# EAGLE board SparkFun GPS RTK Surveyor (EAGLE 9.6.2)
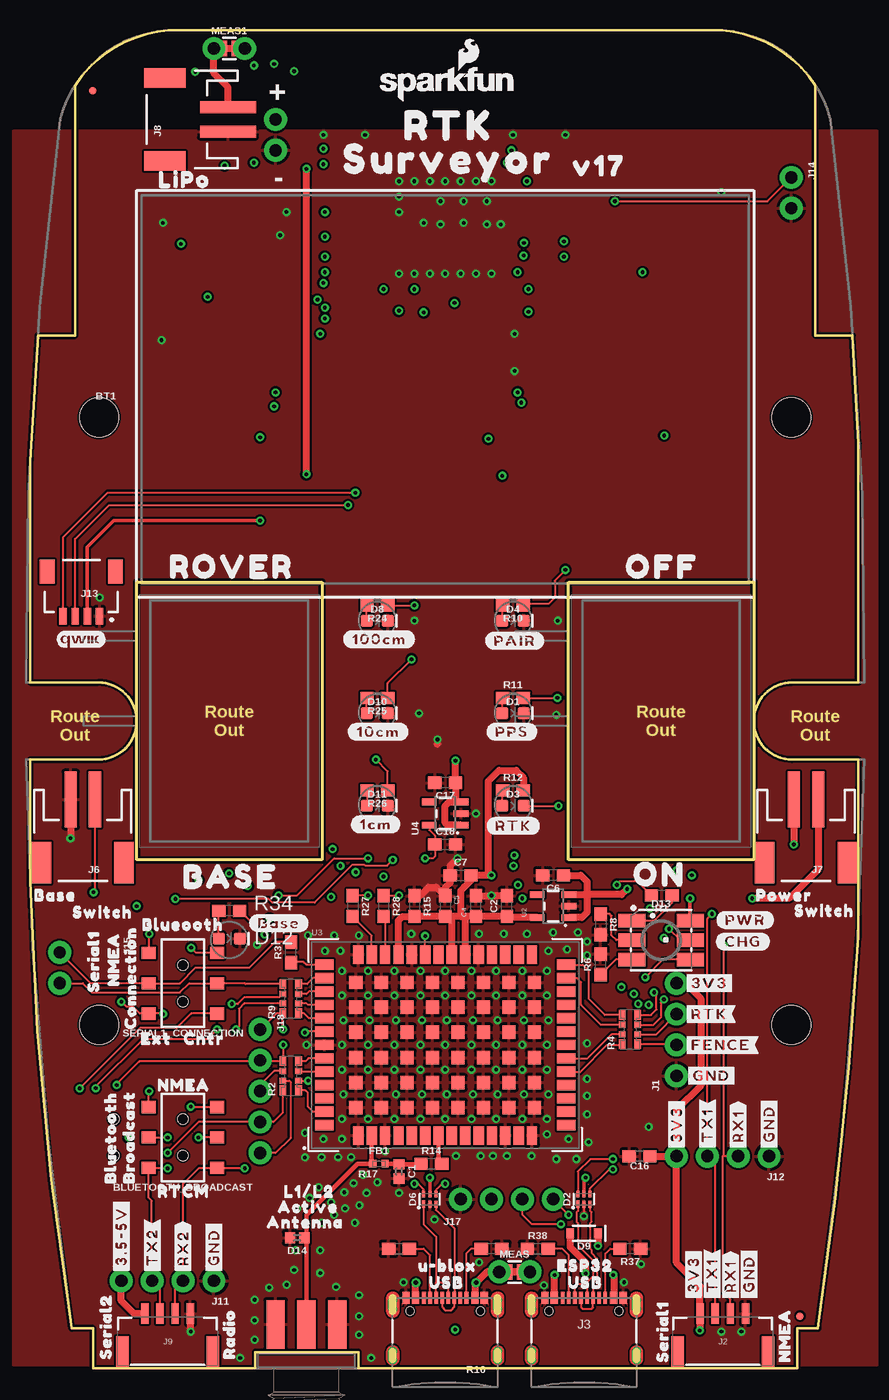
[diagram p2: board, top side]
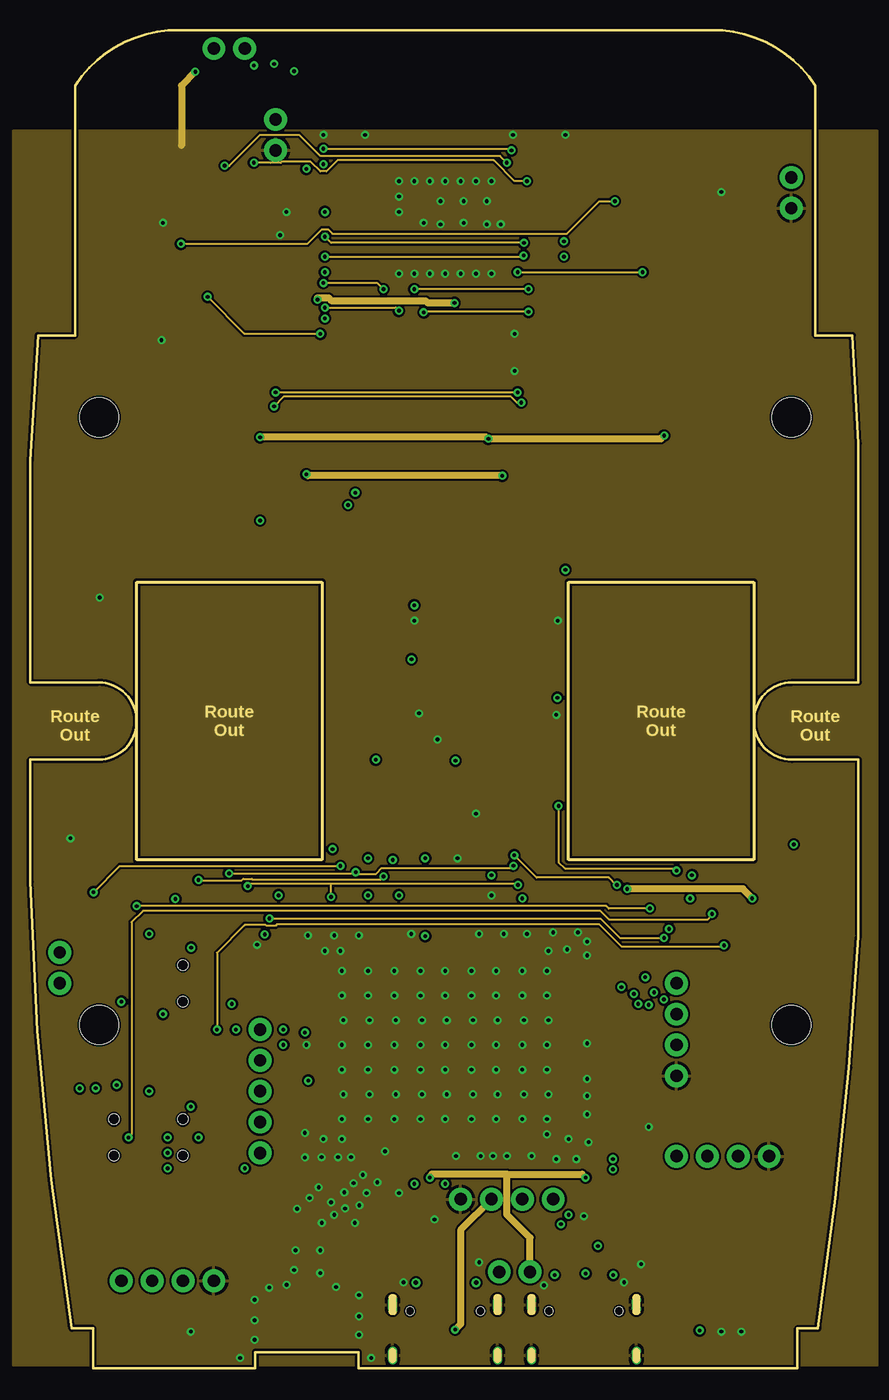
[diagram p3: board, inner layer Horz/GND]
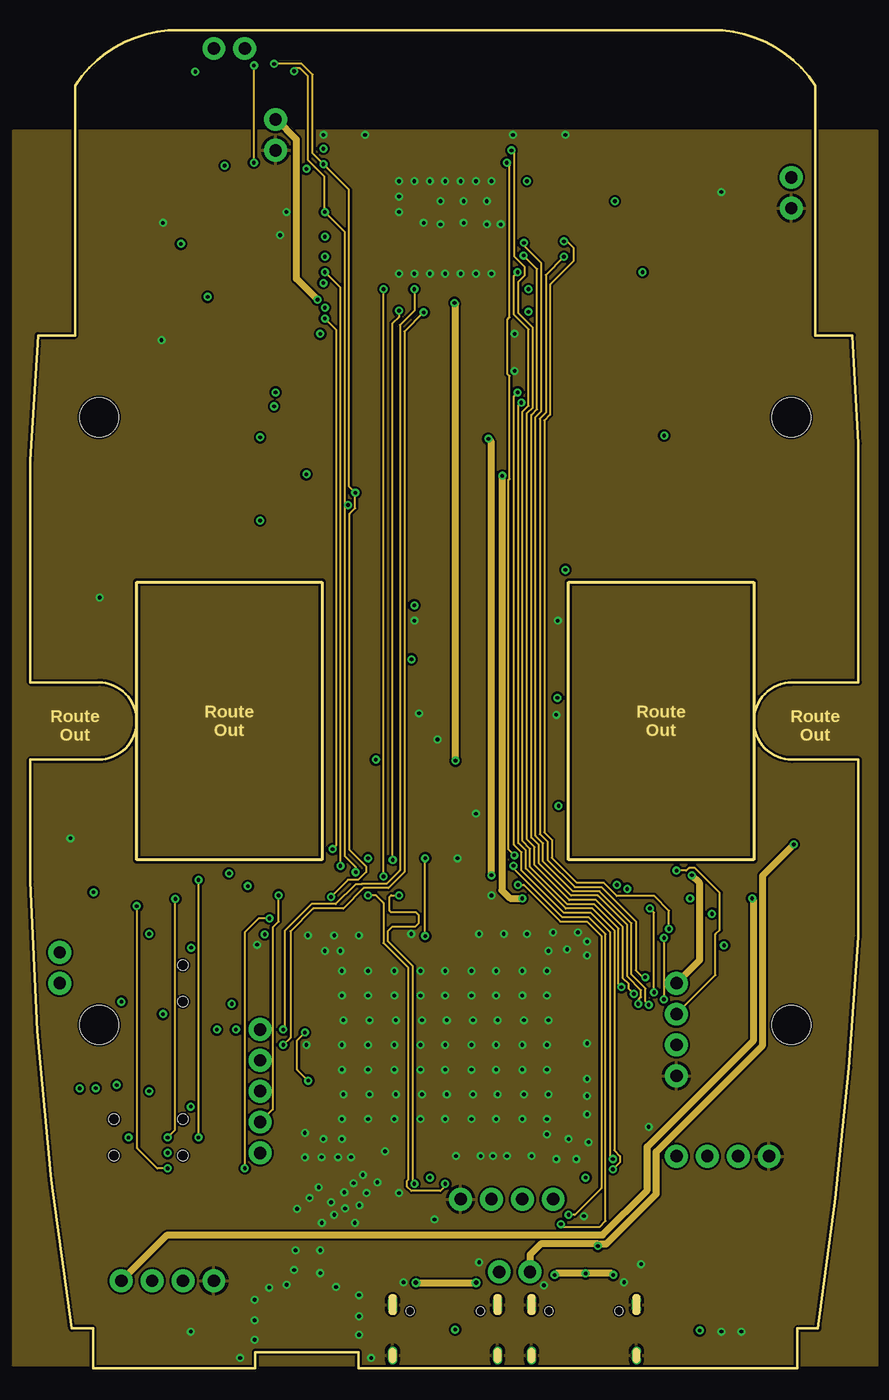
[diagram p4: board, inner layer Vert]
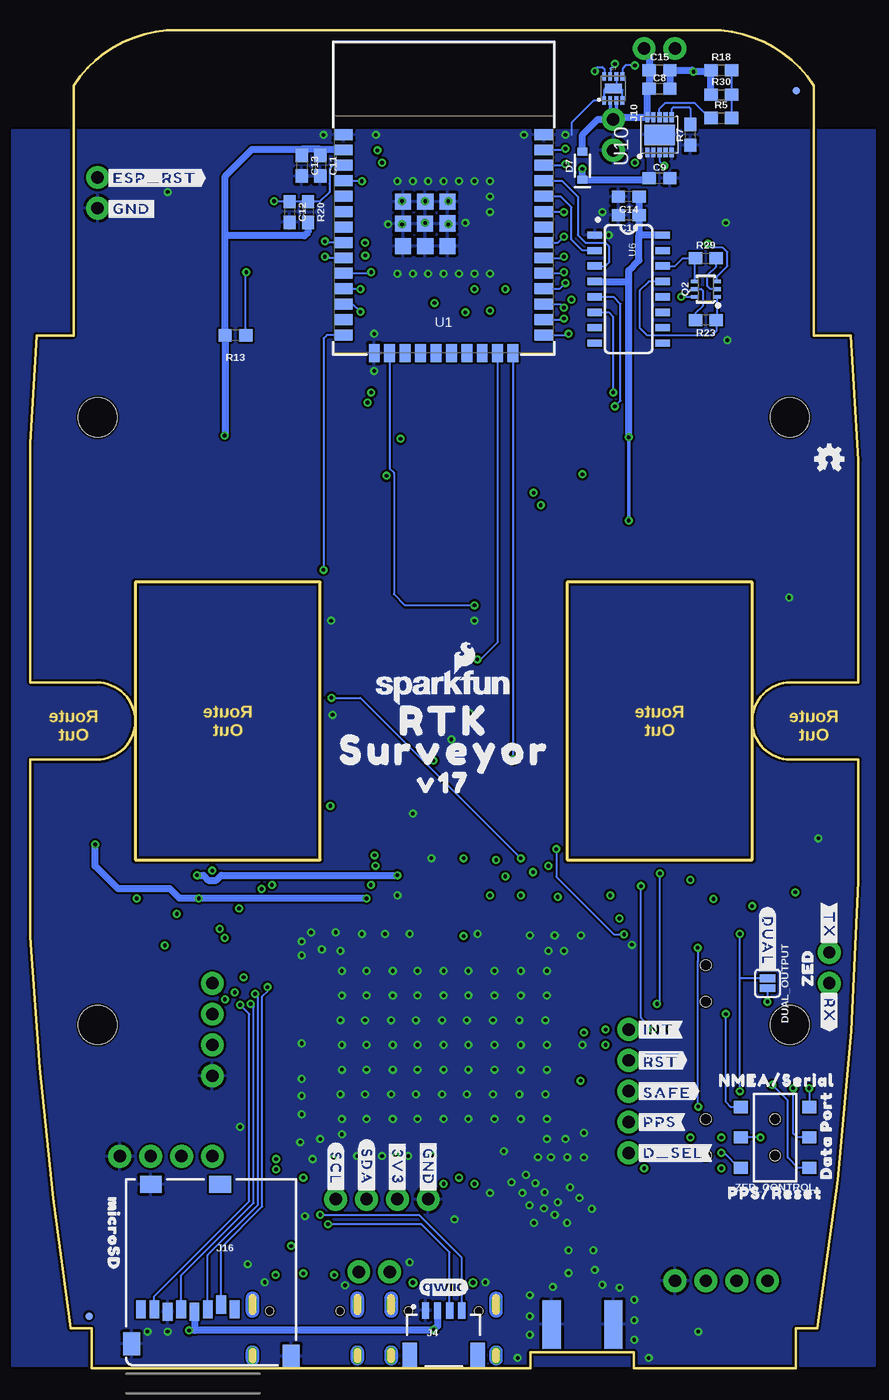
[diagram p5: board, bottom side, seen from below]

Size 68.2 x 110.14 mm. Coordinates in mm from the lower left corner, seen from the top.
Outline: 0,74.74 0,56.45 5.59,56.45 arc-180 5.59,50.1 0,50.1 0,40.07 arc8 3.41,3.27 5.16,3.27 5.16,0 18.51,0 18.51,1.32 27.01,1.32 27.01,0 63.16,0 63.16,3.27 64.86,3.27 arc5 68.2,35.5 68.2,50.1 62.74,50.1 arc-180 62.74,56.45 68.2,56.45 68.2,76.14 67.69,85.03 64.64,85.03 64.64,105.6 arc52 56.97,110.14 11.35,110.14 arc52 3.68,105.6 3.68,85.03 0.63,85.03 0,74.74
Outline: 0,74.74 0,74.87
Outline: 8.76,64.7 24,64.7 24,41.84 8.76,41.84 8.76,64.7
Outline: 44.32,64.7 59.56,64.7 59.56,41.84 44.32,41.84 44.32,64.7
Copper layers (1*2*15*16): Top 0.035559375mm / dielectric 0.47751875mm / Horz/GND 0.035559375mm / dielectric 0.47751875mm / Vert 0.035559375mm / dielectric 0.47751875mm / Bottom 0.035559375mm
Design rules "SparkFun-4-layer-TIGHT *": minimum track width 7mil, minimum drill 12mil, track to track 7mil, track to pad 7mil, pad to pad 7mil, via to via 7mil, smd to smd 7mil, copper to edge 7mil, drill to drill 7mil, minimum pad ring 7mil, minimum via ring 7mil, stop-mask expansion 4mil, vias tented up to drill 25mil, thermal gap 10mil
Net classes: 1 power: width 0.305 mm; 2 3.3V: width 0.559 mm; 3 RF: width 0.35 mm, clearance 0.203 mm

## Footprints (pad centres in the part's own frame; a part is rotated, then mirrored left to right if it is on the bottom)
SWITCH_DPDT_SMD_AYZ0202 = smd 1 x 1.15: 1 -2.5,2.825; 2 0,2.825; 3 2.5,2.825; 4 -2.5,-2.825; 5 0,-2.825; 6 2.5,-2.825 | hole 0.85: 1.5,0; -1.5,0
0402 = smd 0.85 x 0.9: 1 -0.58,0; 2 0.58,0
0603 = smd 1.1 x 1: 1 -0.85,0; 2 0.85,0
LED-0603 = smd 1 x 1: A -0.877,0; C 0.877,0
SOT886 = smd 0.61 x 0.25: 1 -0.405,0.5 | smd 0.56 x 0.25: 2 -0.43,0; 3 -0.43,-0.5; 4 0.43,-0.5; 5 0.43,0; 6 0.43,0.5
SOD-323 = smd 0.63 x 0.83: A 1.15,0; C -1.15,0
LED-TRICOLOR-5050 = smd 2.2 x 1.1: 1 -2.4,1.6; 2 -2.4,0; 3 -2.4,-1.6; 4 2.4,-1.6; 5 2.4,0; 6 2.4,1.6
SMT-JUMPER_2_NO_SILK = smd 0.635 x 1.27: 1 -0.406,0; 2 0.406,0
SMA-EDGE = smd 1.5 x 4: GND@0 -2.54,0; GND@1 2.54,0; SIG 0,0 | smd 1.5 x 4 bottom: GND@2 -2.54,0; GND@3 2.54,0
0402-TIGHT = smd 0.6 x 0.6: 1 -0.5,0; 2 0.5,0
1X04_NO_SILK = drill 1.016 pad 1.88: 1 0,0; 2 2.54,0; 3 5.08,0; 4 7.62,0
JST-4-SMD-1.25MM-LOCKING = smd 0.6 x 1.7: 1 -1.875,3.3; 2 -0.625,3.3; 3 0.625,3.3; 4 1.875,3.3 | smd 1 x 2.7: NC1 3.725,0.1; NC2 -3.725,0.1
USB-C-16P_4LAYER-PADS = smd 0.3 x 1: A5 -1.25,-0.34; A6 -0.25,-0.34; A7 0.25,-0.34; A8 1.25,-0.34; B5 1.75,-0.34; B6 0.75,-0.34; B7 -0.75,-0.34; B8 -1.75,-0.34 | smd 0.6 x 1: GND -3.225,-0.34; GND2 3.225,-0.34; VBUS1 -2.45,-0.34; VBUS2 2.45,-0.34 | drill 0.4 pad 0.6 long: SHLD1 -4.318,-0.915; SHLD2 4.318,-0.915; SHLD3 -4.318,-5.095; SHLD4 4.318,-5.095 | hole 0.65: -2.89,-1.445; 2.89,-1.445
JST04_1MM_RA = smd 0.6 x 1.35: 1 -1.5,0; 2 -0.5,0; 3 0.5,0; 4 1.5,0 | smd 1.2 x 2: NC1 2.8,-3.675; NC2 -2.8,-3.675
JST-2-SMD = smd 1 x 4.6: 1 -1,-3.7; 2 1,-3.7 | smd 1.6 x 3.4: NC1 -3.4,1.5; NC2 3.4,1.5
1X02_NO_SILK = drill 1.016 pad 1.88: 1 0,0; 2 2.54,0
MICRO-SD-SOCKET = smd 1.8 x 1.4: CD1 -2.05,0.4; CD2 -7.75,0.4 | smd 0.8 x 1.5: CS/DAT3 -7.84,10.3; DAT1 -1.24,10.7; DAT2 -8.94,10.7; DI/CMD -6.74,10.7; DO/DAT0 -2.34,10.7; GND -3.44,10.9; SCLK -4.54,10.7; VCC -5.64,10.9 | smd 1.4 x 1.9: GND1 -13.6,14.55; GND3 -0.45,13.55
1X05_NO_SILK = drill 1.016 pad 1.88: 1 0,0; 2 2.54,0; 3 5.08,0; 4 7.62,0; 5 10.16,0
FIDUCIAL-MICRO = smd 0.635 x 0.635: 1 0,0
COMBO-JUMPER_2_NC_TRACE = smd 0.635 x 1.27: 1 -0.508,0; 2 0.508,0 | drill 1.016 pad 1.88: 3 -1.27,0; 4 1.27,0
SC70-6 = smd 0.3 x 0.66: 1 -0.65,-0.92; 2 0,-0.92; 3 0.65,-0.92; 4 0.65,0.92; 5 0,0.92; 6 -0.65,0.92
1206_RA = smd 0.8 x 0.55: P1 -1.2,-0.62; P4 1.2,-0.62; P5 1.2,0.68; P8 -1.2,0.68 | smd 0.5 x 0.55: P2 -0.4,-0.62; P3 0.4,-0.62; P6 0.4,0.68; P7 -0.4,0.68
ESP-WROOM-32D-NARROW = smd 0.9 x 1.5: 1 6.43,8.238; 2 5.16,8.238; 3 3.89,8.238; 4 2.62,8.238; 5 1.35,8.238; 6 0.08,8.238; 7 -1.19,8.238; 8 -2.46,8.238; 9 -3.73,8.238; 10 -5,8.238; 11 -6.27,8.238; 12 -7.54,8.238; 13 -8.81,8.238; 14 -10.08,8.238; 25 -10.08,-8.238; 26 -8.81,-8.238; 27 -7.54,-8.238; 28 -6.27,-8.238; 29 -5,-8.238; 30 -3.73,-8.238; 31 -2.46,-8.238; 32 -1.19,-8.238; 33 0.08,-8.238; 34 1.35,-8.238; 35 2.62,-8.238; 36 3.89,-8.238; 37 5.16,-8.238; 38 6.43,-8.238 | smd 1.5 x 0.9: 15 -11.57,5.715; 16 -11.57,4.445; 17 -11.57,3.175; 18 -11.57,1.905; 19 -11.57,0.635; 20 -11.57,-0.635; 21 -11.57,-1.905; 22 -11.57,-3.175; 23 -11.57,-4.445; 24 -11.57,-5.715 | smd 1.33 x 1.33: GND1 -0.912,1.531; GNDT1 -2.751,3.346; GNDT2 -2.761,1.516; GNDT3 -2.751,-0.314; GNDT4 -0.891,-0.324; GNDT5 0.909,-0.314; GNDT6 0.909,1.516; GNDT7 0.909,3.346; GNDT8 -0.921,3.346
SOT23-5 = smd 0.55 x 1.2: 1 -0.95,-1.3; 2 0,-1.3; 3 0.95,-1.3; 4 0.95,1.3; 5 -0.95,1.3
ZED-F9P = smd 0.85 x 1.52: 1 -7.15,-7.45; 2 -6.05,-7.45; 3 -4.95,-7.45; 4 -3.85,-7.45; 5 -2.75,-7.45; 6 -1.65,-7.45; 7 -0.55,-7.45; 8 0.55,-7.45; 9 1.65,-7.45; 10 2.75,-7.45; 11 3.85,-7.45; 12 4.95,-7.45; 13 6.05,-7.45; 14 7.15,-7.45; 28 7.15,7.45; 29 6.05,7.45; 30 4.95,7.45; 31 3.85,7.45; 32 2.75,7.45; 33 1.65,7.45; 34 0.55,7.45; 35 -0.55,7.45; 36 -1.65,7.45; 37 -2.75,7.45; 38 -3.85,7.45; 39 -4.95,7.45; 40 -6.05,7.45; 41 -7.15,7.45 | smd 1.52 x 0.85: 15 9.95,-6.6; 16 9.95,-5.5; 17 9.95,-4.4; 18 9.95,-3.3; 19 9.95,-2.2; 20 9.95,-1.1; 21 9.95,0; 22 9.95,1.1; 23 9.95,2.2; 24 9.95,3.3; 25 9.95,4.4; 26 9.95,5.5; 27 9.95,6.6; 42 -9.95,6.6; 43 -9.95,5.5; 44 -9.95,4.4; 45 -9.95,3.3; 46 -9.95,2.2; 47 -9.95,1.1; 48 -9.95,0; 49 -9.95,-1.1; 50 -9.95,-2.2; 51 -9.95,-3.3; 52 -9.95,-4.4; 53 -9.95,-5.5; 54 -9.95,-6.6 | smd 1.1 x 1.1: 55 -1.05,-1.05; 56 -3.15,-1.05; 57 -5.25,-1.05; 58 -7.35,-1.05; 59 -1.05,-3.1; 60 -3.15,-3.1; 61 -5.25,-3.1; 62 -7.35,-3.1; 63 -1.05,-5.15; 64 -3.15,-5.15; 65 -5.25,-5.15; 66 -7.35,-5.15; 67 -1.05,5.15; 68 -3.15,5.15; 69 -5.25,5.15; 70 -7.35,5.15; 71 -1.05,3.1; 72 -3.15,3.1; 73 -5.25,3.1; 74 -7.35,3.1; 75 -1.05,1.05; 76 -3.15,1.05; 77 -5.25,1.05; 78 -7.35,1.05; 79 1.05,1.05; 80 3.15,1.05; 81 5.25,1.05; 82 7.35,1.05; 83 1.05,3.1; 84 3.15,3.1; 85 5.25,3.1; 86 7.35,3.1; 87 1.05,5.15; 88 3.15,5.15; 89 5.25,5.15; 90 7.35,5.15; 91 1.05,-5.15; 92 3.15,-5.15; 93 5.25,-5.15; 94 7.35,-5.15; 95 1.05,-3.1; 96 3.15,-3.1; 97 5.25,-3.1; 98 7.35,-3.1; 99 1.05,-1.05; 100 3.15,-1.05; 101 5.25,-1.05; 102 7.35,-1.05
SO016 = smd 0.6 x 1.2: 1 -4.445,-2.8; 2 -3.175,-2.8; 3 -1.905,-2.8; 4 -0.635,-2.8; 5 0.635,-2.8; 6 1.905,-2.8; 7 3.175,-2.8; 8 4.445,-2.8; 9 4.445,2.8; 10 3.175,2.8; 11 1.905,2.8; 12 0.635,2.8; 13 -0.635,2.8; 14 -1.905,2.8; 15 -3.175,2.8; 16 -4.445,2.8
DFN-8 = smd 0.3 x 0.7: 1 -0.75,-0.99; 2 -0.25,-0.99; 3 0.25,-0.99; 4 0.75,-0.99; 5 0.75,0.99; 6 0.25,0.99; 7 -0.25,0.99; 8 -0.75,0.99 | smd 1.38 x 0.8: 9 0,0
DFN-10 = smd 0.8 x 0.35: 1 -1.45,1; 2 -1.45,0.5; 3 -1.45,0; 4 -1.45,-0.5; 5 -1.45,-1; 6 1.45,-1; 7 1.45,-0.5; 8 1.45,0; 9 1.45,0.5; 10 1.45,1 | smd 1.7 x 2.5: 11 0,0
1553DBK-ENCLOSURE = hole 3.2: -25.006,28.499; 25.006,28.499; 25.006,-28.499; -25.006,-28.499

## Placement (x,y rotation side)
BLUETOOTH_BROADCAST  [SWITCH_DPDT_SMD_AYZ0202]  12.57,18.98 90 top
BT1  LIPO-OUTLINE1000  [LIPO-1000]  34.16,80.58 90 top
C1  47pF  [0402]  30.35,16.19 270 top
C2  1.0uF  [0603]  39.24,38.04 90 top
C4  1.0uF  [0603]  36.7,38.04 90 top
C5  0.1uF  [0603]  34.16,38.04 270 top
C6  1.0uF  [0603]  43.05,40.58 180 top
C7  0.1uF  [0603]  35.43,40.58 0 top
C8  4.7uF  [0603]  16.38,105.34 0 bottom
C9  4.7uF  [0603]  16.38,97.98 0 bottom
C10  10uF  [0603]  18.92,94.93 180 bottom
C11  0.1uF  [0603]  44.32,99 270 bottom
C12  0.1uF  [0603]  46.86,95.19 270 bottom
C13  0.1uF  [0603]  45.85,99 270 bottom
C14  10uF  [0603]  18.92,96.45 180 bottom
C15  0.1uF  [0603]  16.38,106.87 0 bottom
C16  0.1uF  [0603]  50.16,17.45 180 top
C17  1.0uF  [0603]  34.16,48.2 180 top
C18  1.0uF  [0603]  34.16,43.12 0 top
D1  Yellow  [LED-0603]  39.75,53.91 0 top
D2  PRTR5V0U2F  [SOT886]  45.59,13.91 90 top
D3  WHITE  [LED-0603]  39.75,46.29 0 top
D4  BLUE  [LED-0603]  39.75,61.53 0 top
D6  PRTR5V0U2F  [SOT886]  32.89,13.91 90 top
D7  3A/10V/280mV  [SOD-323]  22.73,99 90 bottom
D8  GREEN  [LED-0603]  28.58,61.53 0 top
D9  3A/10V/280mV  [SOD-323]  45.59,11.1 180 top
D10  GREEN  [LED-0603]  28.58,53.91 0 top
D11  GREEN  [LED-0603]  28.58,46.29 0 top
D12  RED  [LED-0603]  16.38,35.37 0 top
D13  [LED-TRICOLOR-5050]  51.94,35.24 0 top
D14  PESD0402  [0402]  21.97,10.73 180 top
DUAL_OUTPUT  [SMT-JUMPER_2_NO_SILK]  7.49,31.68 270 bottom
E1  SMA  [SMA-EDGE]  22.73,3.59 180 top
FB1  2.66Ω  [0402-TIGHT]  28.7,16.83 0 top
FRAME1  FRAME-LETTERNO_PACKAGE  [DUMMY]  91.31,6.28 0 top  (outside the outline)
FRAME2  FRAME-LEDGER  [CREATIVE_COMMONS]  91.31,6.28 0 top  (outside the outline)
J1  [1X04_NO_SILK]  53.21,24.06 90 top
J2  [JST-4-SMD-1.25MM-LOCKING]  57.02,1.19 0 top
J3  USB Female Type C Connector  [USB-C-16P_4LAYER-PADS]  45.59,6.14 0 top
J4  External  [JST04_1MM_RA]  34.16,4.74 0 bottom
J5  USB Female Type C Connector  [USB-C-16P_4LAYER-PADS]  34.16,6.14 0 top
J6  Start Base  [JST-2-SMD]  4.32,43.12 180 top
J7  Power Switch  [JST-2-SMD]  63.88,43.12 180 top
J8  [JST-2-SMD]  12.57,102.81 90 top
J9  [JST-4-SMD-1.25MM-LOCKING]  11.3,1.19 0 top
J10  [1X02_NO_SILK]  20.19,102.81 270 bottom
J11  [1X04_NO_SILK]  15.11,7.19 180 top
J12  [1X04_NO_SILK]  60.83,17.45 180 top
J13  Internal  [JST04_1MM_RA]  4.19,61.91 180 top
J14  [1X02_NO_SILK]  62.66,98.03 270 top
J15  [1X02_NO_SILK]  2.41,34.23 270 top
J16  microSD  [MICRO-SD-SOCKET]  60.32,15.54 180 bottom
J17  Qwiic Right Angle  [1X04_NO_SILK]  35.43,13.91 0 top
J18  [1X05_NO_SILK]  18.92,27.88 270 top
JP21  FIDUCIALUFIDUCIAL  [FIDUCIAL-MICRO]  63.37,4.28 0 top
JP61  FIDUCIALUFIDUCIAL  [FIDUCIAL-MICRO]  5.13,105.17 0 top
JP71  FIDUCIALUFIDUCIAL  [FIDUCIAL-MICRO]  63.37,4.28 0 bottom
JP81  FIDUCIALUFIDUCIAL  [FIDUCIAL-MICRO]  5.13,105.17 0 bottom
LOGO1  OSHW-LOGOMINI  [OSHW-LOGO-MINI]  2.41,74.87 0 bottom
LOGO2  SFE_LOGO_NAME_FLAME.1_INCH  [SFE_LOGO_NAME_FLAME_.1]  34.16,56.07 0 bottom
LOGO3  SFE_LOGO_NAME_FLAME.1_INCH  [SFE_LOGO_NAME_FLAME_.1]  34.36,105.73 0 top
MEAS  [COMBO-JUMPER_2_NC_TRACE]  39.88,7.92 0 top
MEAS1  [COMBO-JUMPER_2_NC_TRACE]  16.38,108.65 0 top
Q2  MBT3904DW1T1  [SC70-6]  12.57,88.84 90 bottom
R1  4.7k  [0603]  51.99,38.91 180 top
R2  33  [1206_RA]  21.46,24.06 90 top
R3  33  [0603]  21.46,34.23 90 top
R4  33  [1206_RA]  49.4,27.88 90 top
R5  0  [0603]  11.3,102.93 0 bottom
R6  1k  [0603]  46.96,33.23 90 top
R7  1k  [0603]  13.84,101.53 90 bottom
R8  1k  [0603]  46.96,36.54 270 top
R9  33  [1206_RA]  21.46,30.41 90 top
R10  330  [0603]  39.75,62.8 180 top
R11  20  [0603]  39.75,55.18 0 top
R12  330  [0603]  39.75,47.56 0 top
R13  100k  [0603]  51.31,85.03 180 bottom
R14  10  [0603]  33.02,16.83 0 top
R15  100k  [0603]  31.62,38.04 270 top
R16  5.1k  [0603]  37.97,9.83 180 top
R17  5.1k  [0603]  30.35,9.83 0 top
R18  10k  [0603]  11.3,106.87 0 bottom
R20  10k  [0603]  45.34,95.19 270 bottom
R23  10k  [0603]  12.57,86.3 180 bottom
R24  20  [0603]  28.58,62.8 180 top
R25  20  [0603]  28.58,55.18 180 top
R26  20  [0603]  28.58,47.56 180 top
R27  27  [0603]  26.54,38.04 270 top
R28  27  [0603]  29.08,38.04 270 top
R29  10k  [0603]  12.57,91.38 0 bottom
R30  150k  [0603]  11.3,104.84 0 bottom
R34  330  [0603]  16.38,37.65 180 top
R37  5.1k  [0603]  49.4,9.83 180 top
R38  5.1k  [0603]  41.78,9.83 0 top
SERIAL1_CONNECTION  [SWITCH_DPDT_SMD_AYZ0202]  12.57,31.68 90 top
U1  ESP-WROOM-3232D-NARROW  [ESP-WROOM-32D-NARROW]  34.16,95.14 90 bottom
U2  3.3V  [SOT23-5]  43.05,38.04 90 top
U3  U-BLOX_ZED-F9P  [ZED-F9P]  34.16,26.61 0 top
U4  3.3V  [SOT23-5]  34.16,45.66 90 top
U6  CH340C  [SO016]  18.92,88.84 270 bottom
U7  MAX17048  [DFN-8]  20.19,105.34 0 bottom
U10  MCP73833  [DFN-10]  16.38,101.53 90 bottom
U$1  [#GND#0]  53.85,24.06 0 top
U$2  SPECIAL_INSTRUCTIONS-ORDERING  [ORDERING_INSTRUCTIONS]  82.42,81.22 0 top  (outside the outline)
U$3  [ROCKER_SWITCH]  16.38,53.28 90 top
U$4  [#BASE#0]  18.03,36.64 0 top
U$5  [#3V3#0]  53.21,17.86 90 top
U$6  [ANTENNA0]  18.8,12 0 top
U$7  [RTK0]  34.16,53.28 0 bottom
U$8  [#CHG#0]  58.67,35.11 0 top
U$9  [_SURVEYOR3]  45.34,50.86 0 bottom
U$10  [#RTK#1]  53.72,29.14 0 top
U$11  [#PPS#0]  18.41,20.25 0 bottom
U$12  [#RTK#0]  37.59,44.64 0 top
U$13  [LIGHT_PIPE_3MM]  51.94,35.23 0 top
U$14  [#RX#2]  2.41,31.18 270 bottom
U$15  [LIGHT_PIPE_3MM]  16.39,35.25 0 top
U$16  [ZED0]  4.19,30.8 90 bottom
U$17  [##SAFE##5]  18.41,22.79 0 bottom
U$18  [ACTIVE0]  19.69,13.27 0 top
U$19  [L1#L21]  20.19,14.54 0 top
U$20  [#PAIR#0]  37.47,59.88 0 top
U$21  [LIGHT_PIPE_3MM]  28.56,46.38 0 top
U$22  [BASE2]  11.18,40.45 0 top
U$23  [#3#5#5V#0]  7.49,7.7 90 top
U$24  [#PPS#1]  37.59,52.39 0 top
U$25  [#PWR#2]  56.52,36.89 0 top
U$26  [1553DBK-ENCLOSURE]  34.16,53.28 90 top
U$27  [LIPO0]  12.7,97.85 0 top
U$28  [##RST##4]  18.41,25.33 0 bottom
U$29  [SERIAL10]  52.07,-0.18 90 top
U$30  [QWIIC_4MM]  34.16,6.65 0 bottom
U$31  [OFF1]  47.62,65.98 0 top
U$32  [#FENCE#3]  53.72,26.61 0 top
U$33  [#INT#0]  18.41,27.88 0 bottom
U$34  [ROCKER_SWITCH]  51.94,53.28 90 top
U$35  [U#BLOX0]  31.24,8.43 0 top
U$36  [USB1]  32.13,7.03 0 top
U$37  [#3V3#0]  53.72,31.68 0 top
U$38  [#GND#0]  15.11,7.7 90 top
U$39  [#RX2#2]  12.57,7.7 90 top
U$40  [#TX2#1]  10.03,7.7 90 top
U$41  [BLUETOOTH2]  6.6,14.54 90 top
U$42  [ON0]  48.26,40.65 0 top
U$43  [SERIAL20]  6.22,0.08 90 top
U$44  [ROVER3]  10.03,65.98 0 top
U$45  [#RX1#2]  57.66,5.51 90 top
U$46  [#TX1#1]  56.13,5.51 90 top
U$47  [#3V3#0]  54.61,5.51 90 top
U$48  [#GND#0]  59.18,5.51 90 top
U$49  [NMEA1]  62.1,-0.18 90 top
U$50  [RADIO0]  16.38,0.08 90 top
U$51  [BROADCAST3]  8.13,14.54 90 top
U$52  [NMEA1]  9.78,23.3 0 top
U$53  [RTCM0]  9.78,14.54 0 top
U$54  [BASE0]  -0.38,38.92 0 top
U$55  [SWITCH1]  2.79,37.53 0 top
U$56  [POWER0]  59.05,38.92 0 top
U$57  [SWITCH1]  62.23,37.65 0 top
U$58  [BLUEOOTH3]  8.51,36.51 0 top
U$59  [CNTR1]  11.94,27.11 0 top
U$60  [#ESP_RST#0]  62.1,97.98 0 bottom
U$61  [EXT0]  8.38,27.11 0 top
U$62  [NMEA2]  6.86,30.8 90 top
U$63  [SERIAL10]  5.21,30.29 90 top
U$64  [CONNECTION1]  8.25,27.24 90 top
U$65  [#TX1#1]  55.75,17.86 90 top
U$66  [USB1]  43.56,7.03 0 top
U$67  [ESP320]  42.67,8.43 0 top
U$68  [#RX1#2]  58.29,17.86 90 top
U$69  [LIGHT_PIPE_3MM]  39.76,46.38 0 top
U$70  [#GND#2]  35.43,16.57 270 bottom
U$71  [_SURVEYOR3]  23.16,99.53 0 top
U$72  [#TX#1]  2.41,38.29 270 bottom
U$73  [#DUAL#0]  7.49,37.91 270 bottom
U$74  [RTK0]  34.42,102.3 0 top
U$75  [LIGHT_PIPE_3MM]  39.76,53.98 0 top
U$76  [LIGHT_PIPE_3MM]  39.76,61.58 0 top
U$77  [LIGHT_PIPE_3MM]  28.56,61.58 0 top
U$78  [LIGHT_PIPE_3MM]  28.56,53.98 0 top
U$79  [#1CM#0]  26.42,44.77 0 top
U$80  [#10CM#1]  26.16,52.39 0 top
U$81  [#100CM#2]  25.78,60.01 0 top
U$82  [#GND#0]  60.83,17.86 90 top
U$83  [MICROSD0]  61.34,14.76 270 bottom
U$84  [#GND#1]  62.1,95.44 0 bottom
U$85  [#3V3#2]  37.97,16.57 270 bottom
U$86  [#SCL#1]  43.05,16.45 270 bottom
U$87  [#SDA#0]  40.51,16.57 270 bottom
U$88  [#D_SEL#0]  15.24,17.71 0 bottom
U$89  [DATA2]  2.67,17.33 90 bottom
U$90  [PORT3]  2.67,21.14 90 bottom
U$91  [PPS#RESET0]  6.86,14.41 0 bottom
U$92  [NMEA#SERIAL1]  6.73,23.68 0 bottom
U$93  [QWIIC_4MM]  4.19,59.99 0 top
U$94  [V170]  46.86,99 0 top
U$95  [V170]  34.16,48.2 0 bottom
ZED_CONTROL  [SWITCH_DPDT_SMD_AYZ0202]  6.88,18.98 90 bottom

## Tracks (layer width: path | path; a pad name or v marks a point on that pad's centre or on a via)
3.3V  (via drill 0.3)
  Top 0.305: J13.2 4.69,67.62 6.86,69.78 v18.92,69.78
  Top 0.559: U2.5 39.34,37.09 C2.1 C4.1 35.81,37.19 | 35.81,37.19 35.43,37.19 | 35.43,37.19 34.8,37.19 | 34.8,37.19 C5.2 R15.2 30.65,37.19 30.31,36.85 U3.38 | 35.43,37.19 35.43,39.3 35.75,39.62 36.28,40.16 C7.2 37.72,40.58 | U3.34 34.71,37.1 34.8,37.19 | U3.33 35.81,37.18 35.81,37.19 | v37.97,40.58 37.72,40.58 | J1.4 53.98,31.68 55.21,30.45 55.21,23.25 53.21,21.25 J12.4 | R12.2 40.6,48.62 40.01,49.21 38.61,49.21 37.72,48.32 37.72,40.58 | J12.4 53.21,8.68 55.15,6.75 J2.1 55.15,3.12 v55.12,3.09 | C16.1 J12.4
  Horz/GND 0.559: v18.92,76.64 37.59,76.64 v37.72,76.52 51.94,76.52 v52.2,76.77 | J17.2 35.43,11.37 35.43,3.62 v34.98,3.17
  Vert 0.559: v37.97,40.58 37.97,76.26 v37.72,76.52 | J1.4 55.12,33.59 55.12,39.94 v54.48,40.58
  Bottom 0.305: v18.92,69.78 v18.92,76.64
  Bottom 0.559: 44.32,100.34 45.85,100.34 | C13.1 45.85,100.34 | C11.1 44.32,100.34 | C14.1 C10.1 18.07,93.28 | 18.07,93.28 18.07,91.21 18.92,90.36 18.92,89.47 | U6.16 18.07,93.28 | v18.92,76.64 18.92,89.47 | U6.4 18.92,89.47 | v54.48,40.58 53.95,40.58 53.54,40.17 52.89,40.17 52.48,40.58 v37.97,40.58 | 45.85,100.34 49.96,100.34 52.16,98.14 52.16,93.28 | 52.16,93.28 R13.2 52.16,76.81 v52.2,76.77 | J4.2 34.66,3.48 v34.98,3.17 35.05,3.09 54.61,3.09 | 54.61,3.09 v55.12,3.09 | J16.VCC 54.68,3.17 54.61,3.09 | 52.16,93.28 52.11,93.23 45.65,93.23 45.34,93.54 R20.2 | U1.2 44.27,100.3 44.32,100.34
5V  (via drill 0.3)
  Top 0.559: J9.1 8.54,4.49 7.49,5.54 J11.4 | v49.15,39.46 48.68,38.98 45.85,38.98 | U2.3 45.85,38.98 | C6.1 45.34,40.58 45.85,40.07 45.85,38.98 | 45.85,38.98 45.85,37.53 45.41,37.09 U2.1 | J7.1 64.88,41.07 62.48,38.67 v59.44,38.67
  Horz/GND 0.559: v49.15,39.46 58.67,39.46 58.67,39.43 v59.44,38.67
  Vert 0.559: v59.44,38.67 59.56,38.54 59.56,26.99 50.8,18.22 50.8,14.65 47.12,10.97 11.27,10.97 J11.4
ANT_VCC
  Top 0.351: FB1.2 30.3,16.83 C1.1 32.12,16.77 R14.1
BACKUP  (via drill 0.3)
  Top 0.178: U3.36 v32.51,35.57 | U4.5 32.86,44.29 33.31,43.84 C18.1 33.31,42.14 33.15,41.97 v32.51,41.97
  Vert 0.178: v32.51,35.57 v32.51,41.97
CC1
  Top 0.178: J5.A5 32.91,9.3 32.38,9.83 R17.2
CC2
  Top 0.178: J5.B5 35.91,9.45 36.29,9.83 R16.2
CC3
  Top 0.178: J3.B5 47.34,9.42 47.75,9.83 R37.2
CC4
  Top 0.178: J3.A5 44.34,9.3 43.81,9.83 R38.2
CHG_LED  (via drill 0.3)
  Top 0.178: v48.31,39.79 48.31,39.84 48.52,40.05 49.99,40.05 R1.2
  Horz/GND 0.178: v48.31,39.79 48.24,39.79 47.64,40.39 41.69,40.39 v39.85,42.22 | v39.23,99.25 38.68,99.8 23.88,99.8 22.14,101.53 18.92,101.53 16.38,99 v16,99
  Vert 0.178: v39.23,99.25 39.47,99.01 39.47,86.52 39.28,86.33 39.28,81.86 39.46,81.68 39.46,73.22 39.38,73.14 39.38,42.69 v39.85,42.22
  Bottom 0.178: U10.3 16.38,99.38 v16,99
CHG_THERM1
  Bottom 0.178: R18.2 R30.2 R5.2
D+  (via drill 0.3)
  Top 0.178: D6.4 33.39,14.66 33.91,15.18 v34.16,15.18 | R27.1 26.54,38.92 v27.81,38.92
  Vert 0.178: v34.16,15.18 34.16,14.97 33.77,14.58 31.38,14.58 31.03,14.93 31.03,15.42 31.14,15.54 31.14,32.93 29.08,34.99 29.08,38.29 28.45,38.92 v27.81,38.92
D+1  (via drill 0.3)
  Top 0.178: D2.4 46.09,14.79 47.68,16.37 v47.97,16.37
  Horz/GND 0.178: v40.42,79.49 40.08,79.49 39.6,79.97 20.85,79.97 v20.07,79.18
  Vert 0.178: v40.42,79.49 40.18,79.25 40.18,43.23 40.8,42.61 40.8,41.12 44.09,37.83 46.29,37.83 48.08,36.04 48.08,17.94 48.56,17.45 48.56,16.96 48.21,16.61 v47.97,16.37
  Bottom 0.178: U6.5 20.19,88.2 19.6,87.6 19.6,79.65 v20.07,79.18
D-  (via drill 0.3)
  Top 0.178: D6.6 32.39,14.72 31.93,15.18 v31.62,15.18 | v30.35,38.92 30.31,38.89 R28.1
  Vert 0.178: v31.62,15.18 31.5,15.3 31.5,33.08 29.46,35.11 29.46,36 29.81,36.35 31.71,36.35 32,36.64 32,37.27 31.75,37.53 29.72,37.53 29.59,37.65 29.59,38.8 29.72,38.92 v30.35,38.92
D-1  (via drill 0.3)
  Top 0.178: v47.97,17.21 46.1,17.21 45.09,16.19 D2.6
  Horz/GND 0.178: v40.13,80.33 v20.19,80.33
  Vert 0.178: v40.13,80.33 39.83,80.02 39.83,43.09 40.45,42.47 40.45,40.97 43.95,37.48 46.14,37.48 47.73,35.89 47.73,17.45 v47.97,17.21
  Bottom 0.178: U6.6 20.57,86.93 20.19,86.55 v20.19,80.33
ESP32_!DTR
  Bottom 0.178: Q2.1 11.65,86.37 R23.1 11.72,85.37 12.06,85.03 17.4,85.03 18.03,85.66 18.03,88.71 17.27,89.47 U6.13
ESP32_!RTS
  Bottom 0.178: Q2.4 13.49,91.31 R29.1 14.48,91.38 15.11,90.74 U6.14
ESP32_EN  (via drill 0.3)
  Top 0.178: J14.1 60.7,96.07 v48.13,96.07
  Horz/GND 0.178: v12.4,92.56 22.82,92.56 24.01,93.75 24.5,93.75 24.87,93.39 44.17,93.39 46.86,96.07 v48.13,96.07
  Bottom 0.178: Q2.3 11.65,89.88 10.79,90.74 10.79,91.88 11.18,92.26 12.11,92.26 v12.4,92.56 | v48.13,96.07 48.09,96.03 C12.1 R20.1 44.36,96.03 43.56,96.84 43.56,97.48 43.56,98.75 43.36,98.94 43.28,99.03 U1.3
ESP32_RXI
  Bottom 0.178: U6.2 22.73,92.01 23.62,92.9 23.62,95.57 24.38,96.32 24.54,96.48 U1.34
ESP32_TXO
  Bottom 0.178: U6.3 20.83,90.74 20.57,90.99 20.57,92.39 20.83,92.64 22.48,92.64 23.11,93.28 23.11,96.45 24.23,97.57 24.41,97.75 U1.35
ESP_0/BOOT  (via drill 0.3)
  Horz/GND 0.178: v14.61,88.2 17.62,85.19 23.84,85.19 v23.88,85.15
  Bottom 0.178: Q2.6 14.59,88.19 v14.61,88.2 | U1.25 23.97,85.06 v23.88,85.15
ESP_2/LED_1CM  (via drill 0.3)
  Top 0.178: R26.1 29.42,49.12 v28.45,50.1
  Bottom 0.178: U1.24 v28.45,50.1
ESP_4/LED_BASE_STAT  (via drill 0.3)
  Top 0.178: R34.1 17.27,37.65 19.21,35.71 v19.3,35.71
  Vert 0.178: v24.26,86.42 25.17,85.51 25.17,43.01 v24.89,42.73
  Bottom 0.178: v24.89,42.73 24.89,40.45 20.16,35.71 v19.3,35.71 | U1.26 24.35,86.33 v24.26,86.42
ESP_5/SWITCH_BASE_SELECT  (via drill 0.3)
  Top 0.178: J6.1 5.32,39.29 v5.21,39.18
  Horz/GND 0.178: v5.21,39.18 7.37,41.34 v25.53,41.34
  Vert 0.178: v25.53,41.34 25.53,88.96 v24.26,90.23
  Bottom 0.178: U1.29 24.35,90.14 v24.26,90.23
ESP_12/LED_BLUETOOTH  (via drill 0.3)
  Top 0.178: R10.1 40.6,62.93 42.67,62.93 43.18,63.44 43.18,64.83 v44.07,65.72
  Bottom 0.178: v44.07,65.72 44.07,84.77 43.98,84.86 43.78,85.06 U1.14
ESP_13/LED_100CM  (via drill 0.3)
  Top 0.178: R24.1 v31.62,62.8
  Bottom 0.178: v31.62,62.8 37.34,62.8 38.27,63.73 38.27,73.72 38.61,74.06 U1.16
ESP_15/LED_10CM  (via drill 0.3)
  Top 0.178: R25.1 29.42,56.39 v31.39,58.36
  Bottom 0.178: v31.39,58.36 31.12,58.36 29.72,59.75 U1.23
ESP_16/BT_RXI  (via drill 0.3)
  Top 0.178: v11.94,38.63 19.6,38.63 19.91,38.33 23.41,38.33 26.54,41.45 27.49,41.45 27.57,41.38 29.38,41.38 v29.84,41.84 | BLUETOOTH_BROADCAST.2 v11.3,18.98
  Horz/GND 0.178: v24.26,87.31 30.1,87.31 v30.35,87.06
  Vert 0.178: v11.3,18.98 11.88,19.56 11.88,38.58 v11.94,38.63 | v29.84,41.84 29.84,86.04 30.35,86.55 v30.35,87.06
  Bottom 0.178: v24.26,87.31 24.37,87.43 24.54,87.59 U1.27
ESP_17/BT_TXO  (via drill 0.3)
  Top 0.178: BLUETOOTH_BROADCAST.5 v13.84,18.98
  Horz/GND 0.178: v29.08,40.47 28.84,40.23 18.3,40.23 18.24,40.28 17.53,40.28 17.38,40.13 13.91,40.13 v13.84,40.19 | v29.08,88.84 28.58,89.34 v24.13,89.34
  Vert 0.178: v13.84,18.98 v13.84,40.19 | v29.08,40.47 v29.08,88.84
  Bottom 0.178: U1.28 24.61,88.87 v24.13,89.34
ESP_18/SD_SCK  (via drill 0.3)
  Horz/GND 0.178: v40.62,91.61 40.51,91.5 v24.26,91.5
  Vert 0.178: v50.06,29.98 50.06,30.32 50.29,30.55 50.29,31.11 49.15,32.25 49.15,36.48 46.73,38.9 44.53,38.9 41.87,41.56 41.87,43.05 41.25,43.68 41.25,78.46 41.73,78.95 41.73,90.49 v40.62,91.61
  Bottom 0.178: J16.SCLK 55.78,7.62 49.81,13.6 49.81,29.75 50.04,29.98 v50.06,29.98 | U1.30 24.35,91.41 v24.26,91.5
ESP_19/SD_CIPO  (via drill 0.3)
  Horz/GND 0.178: v40.64,92.64 24.77,92.64 v24.26,93.16
  Vert 0.178: v50.93,29.91 50.66,30.18 50.66,31.24 49.5,32.4 49.5,36.63 46.88,39.25 44.68,39.25 42.23,41.71 42.23,43.2 41.6,43.82 41.6,78.32 42.09,78.8 42.09,90.98 40.64,92.43 v40.64,92.64
  Bottom 0.178: J16.DO/DAT0 57.98,5.93 50.16,13.75 50.16,29.14 v50.93,29.91 | U1.31 24.74,92.67 v24.26,93.16
ESP_21/SDA  (via drill 0.3)
  Top 0.178: R9.P6 20.5,30.53 17.62,30.53 17.07,29.98 v16.59,29.98 | v43.69,11.86 41.29,11.86 40.51,12.63 J17.3 | J13.3 3.69,68.27 6.48,71.06 v26.16,71.06
  Horz/GND 0.178: 26.8,40.7 16.38,40.7 v16.36,40.72 | v39.78,41.36 39.59,41.17 28.94,41.17 28.47,40.7 26.8,40.7 | v26.8,40.83 26.8,40.7
  Vert 0.178: 25.88,71.06 25.88,93.56 v24.26,95.19 24.22,95.22 24.22,98.1 22.86,99.46 22.86,106.36 22.2,107.02 21.84,107.02 21.72,106.89 v21.72,106.78 | 25.88,71.06 25.88,42.17 26.8,41.25 v26.8,40.83 | v43.69,11.86 43.94,11.6 46.86,11.6 47.37,12.11 47.37,35.75 46,37.12 43.8,37.12 39.78,41.14 v39.78,41.36 | v26.16,71.06 25.88,71.06
  Bottom 0.178: v16.59,29.98 16.38,30.19 16.38,40.7 v16.36,40.72 | v24.26,95.19 24.34,95.27 24.39,95.22 U1.33 | J4.3 33.66,9.52 36,11.86 v43.69,11.86 | v21.72,106.78 21.72,106.91 21.5,107.12 21.08,107.12 20.94,106.98 U7.8
ESP_22/SCL  (via drill 0.3)
  Top 0.178: R9.P7 17.61,30.01 17.18,29.59 17.18,28.13 v16.93,27.88 | v44.32,12.62 43.05,13.89 J17.4 | J13.4 2.69,68.41 6.35,72.07 v26.76,72.07
  Horz/GND 0.178: v40.16,39.79 40.07,39.88 24.77,39.88 | 24.77,39.88 18.1,39.88 v17.91,39.69 | v24.77,38.8 24.77,39.88
  Vert 0.178: v44.32,12.62 44.83,12.62 47.02,14.8 47.02,35.6 45.85,36.77 43.65,36.77 40.63,39.79 v40.16,39.79 | v24.77,38.8 26.16,40.19 27.01,40.19 27.65,40.84 27.65,41.29 26.29,42.64 26.29,70.34 26.76,70.81 v26.76,72.07 26.24,72.59 26.24,97.01 v24.13,99.12 23.24,100.01 23.24,106.49 22.35,107.38 v20.07,107.38
  Bottom 0.178: v16.93,27.88 17.91,28.85 v17.91,39.69 | J4.4 32.66,9.09 36.2,12.62 v44.32,12.62 | v20.07,107.38 20.44,107 U7.7 | U1.36 24.23,99.03 24.18,99.08
  Bottom 0.254: 24.18,99.08 v24.13,99.12
ESP_23/SD_COPI  (via drill 0.3)
  Horz/GND 0.178: v24.13,100.39 39.5,100.39 v39.62,100.27
  Vert 0.178: v49.7,30.8 49.28,31.22 49.28,31.62 48.79,32.1 48.79,36.34 46.59,38.54 44.39,38.54 41.52,41.41 41.52,42.91 40.89,43.53 40.89,78.61 41.38,79.09 41.38,85.68 40.18,86.87 40.18,89.44 40.73,89.98 40.73,90.65 39.83,91.55 39.83,100.06 v39.62,100.27
  Bottom 0.178: J16.DI/CMD 53.59,9.32 49.45,13.45 49.45,30.56 v49.7,30.8 | U1.37 24.23,100.3 v24.13,100.39
ESP_25/SD_!CS!  (via drill 0.3)
  Horz/GND 0.178: v40.13,90.23 v50.42,90.23
  Vert 0.178: v48.68,31.37 48.44,31.61 48.44,36.19 46.44,38.19 44.24,38.19 41.16,41.27 41.16,42.76 40.54,43.38 40.54,78.76 41.02,79.24 41.02,85.53 39.83,86.73 39.83,89.93 v40.13,90.23
  Bottom 0.178: R13.1 50.46,90.19 v50.42,90.23 | v48.68,31.37 48.68,31.03 49.1,30.61 49.1,13.3 52.48,9.92 J16.CS/DAT3 | U1.10 40.23,90.14 v40.13,90.23
ESP_26/ZED_TX_READY  (via drill 0.3)
  Top 0.178: v20.83,27.88 20.78,27.92 R9.P8 20.26,29.21 J18.1
  Horz/GND 0.178: v41.02,88.84 v31.62,88.84
  Vert 0.178: v31.62,88.84 31.62,87.06 30.44,85.88 30.44,40.99 29.33,39.88 27.31,39.88 27.27,39.84 26.78,39.84 25.15,38.2 23.15,38.2 20.95,36 20.95,28 v20.83,27.88
  Bottom 0.178: U1.11 41.05,88.87 v41.02,88.84
ESP_26/ZED_TX_READY_LV
  Top 0.178: U3.46 22.95,28.8 22.54,29.21 R9.P1
ESP_27/ZED_!RESET!  (via drill 0.3)
  Top 0.178: v20.83,26.61 20.83,25.31 R2.P5 18.99,25.26 J18.2 18.83,25.25 8.97,25.25 7.11,23.39 v7.11,23.3
  Horz/GND 0.178: v41.02,86.97 32.42,86.97 v32.38,86.93
  Vert 0.178: v20.83,26.61 21.43,27.2 21.43,35.97 23.3,37.84 25.78,37.84 27.46,39.52 29.48,39.52 30.8,40.84 30.8,85.34 v32.38,86.93
  Bottom 0.178: ZED_CONTROL.4 4.99,16.48 5.84,17.33 5.84,22.03 v7.11,23.3 | U1.12 41.65,87.59 v41.02,86.97
ESP_27/ZED_!RESET!_LV
  Top 0.178: U3.49 22.9,25.5 22.66,25.26 R2.P4
ESP_32/PWR_LVL_RED  (via drill 0.3)
  Top 0.178: D13.5 53.51,35.24 v52.6,36.16
  Vert 0.178: v43.94,92.77 44.2,92.77 44.7,92.26 44.7,91.12 42.8,89.22 42.8,78.5 42.32,78.02 42.32,44.12 42.94,43.5 42.94,42 44.98,39.97 47.18,39.97 48.29,38.86 51.4,38.86 52.6,37.66 v52.6,36.16
  Bottom 0.178: v43.94,92.77 43.93,92.76 43.89,92.73 43.84,92.67 U1.8
ESP_33/PWR_LVL_GRN  (via drill 0.3)
  Top 0.178: D13.4 52.1,33.64 v50.64,32.18
  Vert 0.178: v43.94,91.5 42.44,90 42.44,78.65 41.96,78.17 41.96,43.97 42.58,43.35 42.58,41.86 44.83,39.61 47.03,39.61 49.86,36.78 49.86,32.76 50.44,32.18 v50.64,32.18
  Bottom 0.178: U1.9 43.84,91.41 v43.94,91.5
ESP_36/BATT_ALRT  (via drill 0.3)
  Horz/GND 0.178: v40.89,97.73 39.88,97.73 38.16,99.44 25.29,99.44 24.38,98.53 23.88,98.53 23.07,99.34 20.72,99.34 20.62,99.24 19.77,99.24 19.75,99.25 v18.41,99.25
  Vert 0.178: v18.41,99.25 v18.41,107.25
  Bottom 0.178: v40.89,97.73 40.97,97.81 41.02,97.75 U1.4 | v18.41,107.25 19.18,107.25 19.44,106.98 U7.5
ESP_D1+
  Top 0.178: D2.3 46.09,12.97 46.22,12.84 46.22,12.06 46.14,11.98 46.14,9.81 46.23,9.72 46.23,9.46 46.67,9.02 46.67,7.4 46.34,7.07 J3.B6 46.34,5 46.23,4.89 45.47,4.89 45.34,5.01 J3.A6
ESP_D1-
  Top 0.178: 45.84,6.92 45.84,7.07 46.32,7.55 46.32,8.87 45.09,10.09 45.09,11.94 44.98,12.06 44.98,12.82 45.09,12.94 D2.1 | 45.84,6.92 J3.A7 | J3.B7 44.84,6.68 45.09,6.92 45.84,6.92
EXTERNAL_SERIAL1_RXI  (via drill 0.3)
  Top 0.178: v4.06,23.02 9.04,28 12.06,28 13.25,29.18 SERIAL1_CONNECTION.4
  Bottom 0.178: v4.06,23.02 ZED_CONTROL.6
EXTERNAL_SERIAL1_RXI/ZED_!RESET!  (via drill 0.3)
  Top 0.178: J12.2 57.12,17.45 | 57.12,17.45 57.02,17.45 57.02,6.28 57.65,5.66 J2.3 | 57.12,17.45 v57.12,34.8 | v5.38,23.05 5.38,23.18 9.28,27.07 14.57,27.07 v15.37,27.88
  Horz/GND 0.178: v15.37,27.88 15.37,34.19 17.65,36.47 19.39,36.47 19.44,36.42 20.19,36.42 20.27,36.51 46.86,36.51 48.68,34.7 57.03,34.7 v57.12,34.8
  Bottom 0.178: ZED_CONTROL.5 5.05,18.98 5.38,19.31 v5.38,23.05
EXTERNAL_SERIAL1_TXO  (via drill 0.3)
  Top 0.178: v10.92,29.14 10.88,29.18 SERIAL1_CONNECTION.1 9.01,29.18 8.45,29.74 7.91,29.74 v7.49,30.16
  Bottom 0.178: ZED_CONTROL.3 10.5,21.48 10.92,21.91 v10.92,29.14 | DUAL_OUTPUT.2 v7.49,30.16
EXTERNAL_SERIAL1_TXO/PPS  (via drill 0.3)
  Top 0.178: v56.13,37.4 55.75,37.02 J12.3 56.4,16.8 J2.2
  Horz/GND 0.178: v56.13,37.4 56.13,37.29 55.75,36.91 47.68,36.91 46.93,37.65 9.27,37.65 8.33,36.71 8.33,19.24 v8.08,18.98
  Bottom 0.178: v8.08,18.98 ZED_CONTROL.2
FENCE_LV
  Top 0.178: U3.19 45.29,24.4 47.49,26.61 48.65,26.61 R4.P8
GND  (via drill 0.3)
  Top 0.178: D2.2 45.59,12.41 45.62,12.38
  Top 0.559: C4.2 37.93,38.89 | 37.93,38.89 v37.97,38.92 | C2.2 37.93,38.89 | v35.18,41.97 34.58,41.38 C7.1 34.58,39.98 34.16,39.56 C5.1 34.13,38.89 33.44,39.58 32.78,39.58 32.08,38.89 R15.1 | 33.56,51.41 33.53,51.37 | J9.4 13.18,3.03 v13.21,3 | J6.2 3.32,43.64 v3.3,43.62
  Horz/GND 0.559: v13.59,106.74 12.45,105.6 12.45,100.65
  Bottom 0.178: U7.4 19.44,105.23 19.56,105.34 19.94,105.34 | 19.94,105.34 U7.9 20.83,105.34 20.94,105.23 U7.1 21.82,104.36 23.62,102.55 23.62,101.53 | U7.6 19.94,105.35 19.94,105.34
  Bottom 0.559: C8.2 C15.2 13.72,106.87 v13.59,106.74 12.28,106.74 R18.1 R30.1
  other vias: 42.29,6.81 56.9,3 30.35,14.41 33.27,12.24 36.96,8.71 30.73,7.06 10.92,94.3 10.79,84.64 21.08,95.19 20.57,93.28 27.94,28.64 30.1,28.64 32.26,28.64 34.29,28.64 36.45,28.64 38.48,28.64 40.64,28.64 42.67,28.64 25.78,28.64 27.81,30.67 29.97,30.67 32.13,30.67 34.16,30.67 36.32,30.67 38.35,30.67 40.51,30.67 42.54,30.67 25.65,30.67 27.81,32.7 29.97,32.7 32.13,32.7 34.16,32.7 36.32,32.7 38.35,32.7 40.51,32.7 42.54,32.7 25.65,32.7 27.94,22.54 30.1,22.54 32.26,22.54 34.29,22.54 36.45,22.54 38.48,22.54 40.64,22.54 42.67,22.54 25.78,22.54 27.81,24.57 29.97,24.57 32.13,24.57 34.16,24.57 36.32,24.57 38.35,24.57 40.51,24.57 42.54,24.57 25.65,24.57 27.81,26.61 29.97,26.61 32.13,26.61 34.16,26.61 36.32,26.61 38.35,26.61 40.51,26.61 42.54,26.61 25.65,26.61 27.81,20.51 29.97,20.51 32.13,20.51 34.16,20.51 36.32,20.51 38.35,20.51 40.51,20.51 42.54,20.51 25.65,20.51 25.34,17.36 38.1,17.46 35.05,17.46 37.08,17.46 39.24,17.46 41.27,17.46 23.98,17.36 22.86,35.62 25.02,35.62 27.05,35.62 31.37,35.75 36.96,35.75 38.99,35.75 40.89,35.75 43.05,35.88 45.09,35.88 45.85,33.97 45.85,26.73 45.85,23.81 45.85,22.41 45.85,20.89 45.97,18.6 45.85,35.11 42.54,19.24 44.96,17.21 43.31,17.21 26.41,17.36 27.38,15.92 26.62,15.23 25.85,14.47 24.77,13.65 23.75,14.89 22.99,14 24,11.96 21.72,8.08 21.1,6.85 25.17,6.68 23.88,7.82 19.67,6.63 18.47,5.63 18.47,3.93 17.27,0.84 18.47,2.34 25.02,12.62 25.91,13.13 22.61,17.33 22.61,19.37 24.13,18.86 22.73,26.61 21.97,13.11 27.1,13.4 27.69,14.41 28.58,15.3 26.72,11.96 27.07,6 27.07,4.26 27.07,2.74 28.07,0.84 29.21,17.84 25.65,18.86 25.53,34.35 24.26,34.35 42.67,34.35 44.2,34.48 44.32,18.86 33.53,51.75 21.84,9.7 23.88,9.7 56.9,96.84 43.31,53.78 32,53.91 31.62,61.53 43.43,61.53 30.35,95.19 30.35,96.45 37.59,96.07 37.59,94.17 36.7,90.11 35.43,90.11 34.16,90.11 32.89,90.11 31.62,90.11 30.35,90.11 30.35,97.73 31.62,97.73 32.89,97.73 34.16,97.73 35.43,97.73 36.7,97.73 37.97,97.73 37.97,90.11 38.73,94.17 32.38,94.3 33.78,94.17 33.78,96.07 35.69,96.07 35.69,94.3 58.55,3 48.89,7.06 24.13,101.53 44.07,101.53 39.75,101.53 27.56,101.53 39.88,85.15 39.88,82.1 36.7,45.66 18.67,34.86 50.93,19.86 50.29,8.55 45.59,12.51 5.71,63.44
  pour Top (isolate 0.152, rank 4): -1.4,101.91 69.72,101.91 69.72,0.21 -1.4,0.21
  pour Bottom (isolate 0.152, rank 4): -1.4,101.91 69.72,101.91 69.72,0.21 -1.4,0.21
  pour Horz/GND (isolate 0.152, rank 4): -1.4,101.91 69.72,101.91 69.72,0.17 -1.4,0.17
  pour Vert (isolate 0.152, rank 4): -1.4,101.91 69.72,101.91 69.72,0.17 -1.4,0.17
GPS_ANT1
  Top 0.35: 22.73,12.6 22.73,12.62 26.94,16.83 FB1.1 28.11,16.91 28.11,17.98 | D14.1 22.73,10.74
  Top 0.351: U3.2 28.11,17.98 | 22.73,12.6 22.73,10.74 E1.SIG
LIPO_RAW
  Top 0.559: J8.2 16.27,105.45 15.11,106.62 MEAS1.3 MEAS1.1
N$1
  Top 0.178: D3.A 38.87,47.53 R12.1
N$2
  Top 0.178: D1.A 38.87,55.15 R11.1
N$3
  Top 0.178: D4.A 38.87,62.77 R10.2
N$4  (via drill 0.38)
  Top 0.559: J5.VBUS1 31.71,6.99 v31.75,7.03 | J5.VBUS2 36.61,6.94 v36.7,7.03 37.59,7.92 MEAS.3 MEAS.1
  Vert 0.559: v31.75,7.03 v36.7,7.03
N$5
  Bottom 0.178: U10.8 16.38,103.69 15.9,104.18 13.52,104.18 12.28,102.93 R5.1
N$6
  Top 0.178: D13.1 51.37,36.84 52.84,38.31 R1.1
N$7
  Top 0.178: D13.3 48.22,33.64 R6.1
N$8
  Top 0.178: D13.2 48.26,35.24 47.86,35.64 47.86,37.23 47.71,37.39 R8.1
N$11
  Top 0.178: U3.40 28.11,35.62 R27.2
N$12
  Top 0.178: R28.2 29.21,37.05 U3.39
N$13
  Top 0.351: U3.7 33.61,17.08 R14.2
N$24
  Bottom 0.178: Q2.5 12.95,88.84 12.83,88.71 12.83,87.44 13.42,86.84 R23.2
N$25
  Bottom 0.178: Q2.2 12.19,88.84 12.45,89.09 12.45,89.98 11.72,90.7 R29.2
N$26
  Top 0.178: D8.A 27.7,62.77 R24.2
N$27
  Top 0.178: D10.A 27.7,55.15 R25.2
N$29
  Top 0.178: R26.2 27.73,46.32 D11.A
N$30
  Top 0.178: D12.A 15.51,37.63 R34.2
N$32  (via drill 0.3)
  Top 0.559: J3.VBUS1 43.14,7.63 v43.18,7.67 | v48.01,7.67 48.04,7.63 J3.VBUS2 | D9.A 44.44,9.97 45.72,8.69 v45.72,7.79
  Vert 0.559: v43.18,7.67 43.31,7.79 v45.72,7.79 47.88,7.79 v48.01,7.67
NMEA-RX  (via drill 0.3)
  Top 0.178: SERIAL1_CONNECTION.6 13.67,34.19 v13.25,34.61 | v13.21,21.52 15.36,21.52 BLUETOOTH_BROADCAST.6
  Bottom 0.178: v13.25,34.61 13.25,33.49 13.27,33.47 13.27,21.58 v13.21,21.52
NMEA-TX  (via drill 0.3)
  Top 0.178: BLUETOOTH_BROADCAST.3 9.75,22.76 v9.78,22.79 | SERIAL1_CONNECTION.3 9.78,34.22 v9.78,35.75
  Bottom 0.178: v9.78,22.79 9.78,32.07 | 9.78,32.07 v9.78,35.75 | DUAL_OUTPUT.1 9.75,32.09 9.78,32.07
PPS
  Top 0.178: U3.53 23.28,21.11 22.86,21.52 22.86,22.67 22.66,22.86 R2.P1
PROG1
  Bottom 0.178: U10.6 15.38,103.68 15.24,103.82 13.97,103.82 13.84,103.69 R7.2
RTK_LV
  Top 0.178: U3.20 45.89,25.5 47.86,27.47 R4.P7
RX2_LV
  Top 0.178: U3.26 45,32.11 45.34,31.76 45.34,29.91 46.97,28.27 R4.P6
RXLV
  Top 0.178: U3.43 23.28,32.11 22.79,31.61 R9.P4
SCL_LV
  Top 0.178: U3.45 22.86,29.9 22.75,30.01 R9.P2
SDA_LV
  Top 0.178: U3.44 22.94,31 22.73,30.8 22.1,30.8 R9.P3
TX2_LV
  Top 0.178: R4.P5 47.31,29.07 45.96,30.43 45.96,32.73 45.49,33.21 U3.27
TXLV
  Top 0.178: U3.42 22.74,33.21 22.48,33.46 21.55,33.46 R3.1
UNP_D+
  Top 0.178: J5.A6 33.91,5.03 34.16,4.78 34.67,4.78 34.92,5.03 34.92,5.79 | 34.92,5.79 J5.B6 | D6.3 33.39,13.02 34.92,11.49 34.92,5.79
UNP_D-
  Top 0.178: 33.41,7.06 34.16,7.06 34.41,6.81 J5.A7 | J5.B7 33.41,7.06 | 33.41,7.06 33.41,10.83 32.39,11.85 D6.1
V_BATT  (via drill 0.3)
  Top 0.559: U4.1 34.35,44.71 34.16,44.89 34.16,46.29 34.48,46.61 35.05,46.61 | 35.05,46.61 U4.3 | 35.05,46.61 35.01,46.64 C17.1 v35.01,50.01 | MEAS1.2 MEAS1.4
  Horz/GND 0.559: v34.92,87.69 32.74,87.69 32.57,87.86 24.82,87.86 24.58,88.1 23.64,88.1 v23.64,87.97
  Vert 0.559: v35.01,50.01 35.01,87.61 v34.92,87.69 | v23.64,87.97 21.92,89.69 21.92,101.15 20.27,102.81 J10.1
  Bottom 0.305: 20.44,103.06 U7.2 | 19.94,103.06 U7.3 | U10.9 U10.10
  Bottom 0.559: MEAS1.4 17.23,108.23 C15.1 C8.1 17.38,105.2 U10.10 20.01,102.98 J10.1 | D7.A 22.73,101.53 21.46,102.81 J10.1 | J10.1 19.94,103.06 | J10.1 20.44,103.06
VIN  (via drill 0.3)
  Top 0.305: D6.5 v32.89,15.68 | D2.5 45.59,15.56 v45.72,15.68 | D13.6 54.33,36.85 v54.33,38.67
  Top 0.559: v22.73,73.59 v22.73,98.74 | v62.86,43.12 62.88,43.13 J7.2 | D9.C v46.74,10.06 v46.74,10.05 | MEAS.2 MEAS.4
  Horz/GND 0.559: v38.86,73.47 22.86,73.47 v22.73,73.59 | v32.89,15.68 32.89,15.78 33.08,15.96 39.27,15.96 | MEAS.4 41.15,10.73 39.24,12.63 39.24,15.94 39.27,15.96 | 39.27,15.96 45.44,15.96 v45.72,15.68
  Vert 0.559: v38.86,73.47 38.86,73.44 38.84,73.41 38.84,39.33 39.5,38.67 v40.51,38.67 | v62.86,43.12 60.3,40.55 60.3,26.58 51.54,17.82 51.54,14.35 47.42,10.23 46.91,10.23 v46.74,10.05 46.74,10.23 42.04,10.23 41.15,9.34 MEAS.4
  Bottom 0.559: v40.51,38.67 v54.33,38.67 55.91,38.67 56.7,39.46 60.98,39.46 62.86,41.34 v62.86,43.12 | 17.38,98.13 C9.1 17.37,97.84 D7.C v22.73,98.74
  pour Bottom (isolate 0.305, no thermals): 17.4,100.27 17.4,97.73 16.89,97.73 16.89,100.27
ZED-RXI1
  Top 0.178: R9.P5 17.72,31.61 17.65,31.68 SERIAL1_CONNECTION.5 13.08,31.68 12.31,30.92 5.09,30.92 4.32,31.68 J15.2
ZED-RXI2  (via drill 0.3)
  Top 0.178: J9.3 11.93,6.54 J11.2 12.57,15.18 13.88,16.48 BLUETOOTH_BROADCAST.4 15.44,16.45 v17.65,16.45 | R4.P3 51.33,28.27 51.92,28.87 51.92,30.09 v52.17,30.35
  Horz/GND 0.178: v52.19,35.42 48.53,35.42 46.94,37.02 v19.69,37.02
  Vert 0.178: v19.69,37.02 18.8,37.02 17.65,35.88 v17.65,16.45 | v52.19,35.42 52.17,35.41 v52.17,30.35
ZED-TXO1
  Top 0.178: R3.2 21.42,35.11 20.19,35.11 18.03,32.96 13.59,32.96 12.32,31.68 SERIAL1_CONNECTION.2 4.95,31.68 J15.1
ZED-TXO2  (via drill 0.3)
  Top 0.178: R4.P4 51.11,29.07 51.56,29.53 51.56,30.74 v51.36,30.93 | J9.2 10.68,6.54 J11.3 9.99,7.23 9.99,13.76 9.75,14 BLUETOOTH_BROADCAST.1 11.26,16.48 v11.3,16.45
  Horz/GND 0.178: v8.76,38.04 47.43,38.04 47.63,37.84 v51.02,37.84
  Vert 0.178: v11.3,16.45 10.46,16.45 8.8,18.1 8.8,38 v8.76,38.04 | v51.36,30.93 51.36,37.5 v51.02,37.84
ZED_!SAFE!
  Top 0.178: R2.P6 20.09,24.46 18.92,23.3 J18.3
ZED_!SAFE!_LV
  Top 0.178: U3.50 22.14,24.4 R2.P3
ZED_D_SEL
  Top 0.178: R2.P7 21.33,23.66 21.41,23.58 21.41,18.93 20.19,17.71 J18.5
ZED_D_SEL_LV  (via drill 0.3)
  Top 0.178: R2.P2 v22.88,23.66 | U3.47 22.69,27.7 v22.61,27.62
  Vert 0.178: v22.88,23.66 21.97,24.57 21.97,26.99 v22.61,27.62
ZED_FENCE_STAT
  Top 0.178: R4.P1 53.14,26.67 J1.2
ZED_PPS_STAT  (via drill 0.3)
  Top 0.178: v20.45,38.92 21.97,38.92 25.02,41.97 v27.81,41.97 | R11.2 v43.41,55.18 | R2.P8 20.78,21.02 20.02,20.25 J18.4 13.84,20.25 v11.3,17.71
  Vert 0.178: v20.45,38.92 20.45,36.77 19.95,36.27 19.95,21.28 J18.4
  Bottom 0.178: v27.81,41.97 41.02,55.18 v43.41,55.18 | v11.3,17.71 11.06,17.71 9.84,16.48 ZED_CONTROL.1
ZED_RTK_STAT  (via drill 0.3)
  Top 0.178: R4.P2 51.54,27.47 J1.3 | D3.C v43.49,46.29 v43.5,46.29
  Horz/GND 0.178: v53.21,40.96 53.02,41.14 44,41.14 43.5,41.65 v43.5,46.29
  Vert 0.178: J1.3 56.43,32.36 56.43,35.74 56.76,36.08 56.76,39.14 54.73,41.17 54.24,41.17 54.02,40.96 v53.21,40.96

## Text on the board
Dimension: Route / Out | Route / Out
tPlace: + | -
Milling: Route / Out | Route / Out
tDocu: Board thickness is 1.6mm | 4 Layer Board | No clean process | Top PCB surface to inside lid: 11.9mm | Top PCB surface to inside lid: 11.9mm | Inside height: 18.5mm | Thckness of top cover: 2.25mm | 12x12mm switch height: 8.5mm | Rocker height: 16.7mm | LED Height: 0.8mm | Gap to base switch: 3.4mm | Top Cover thickness: 2.25mm | Recommended air gap: 0.5-1.27mm | Pipe length: 12.08-12.85mm | 12.7mm / 0.5" is common | 10.16mm / 0.4" is common | -ND | -ND | 350-3726-ND (Flat $0.25) | 350-3725-ND (Flat $0.25) | 350-3738-ND (Dome $0.25) | NA | Face to Lid / LEDs this side | Connectors